# EAGLE design SerialKeyboard (EAGLE 9.4.2)
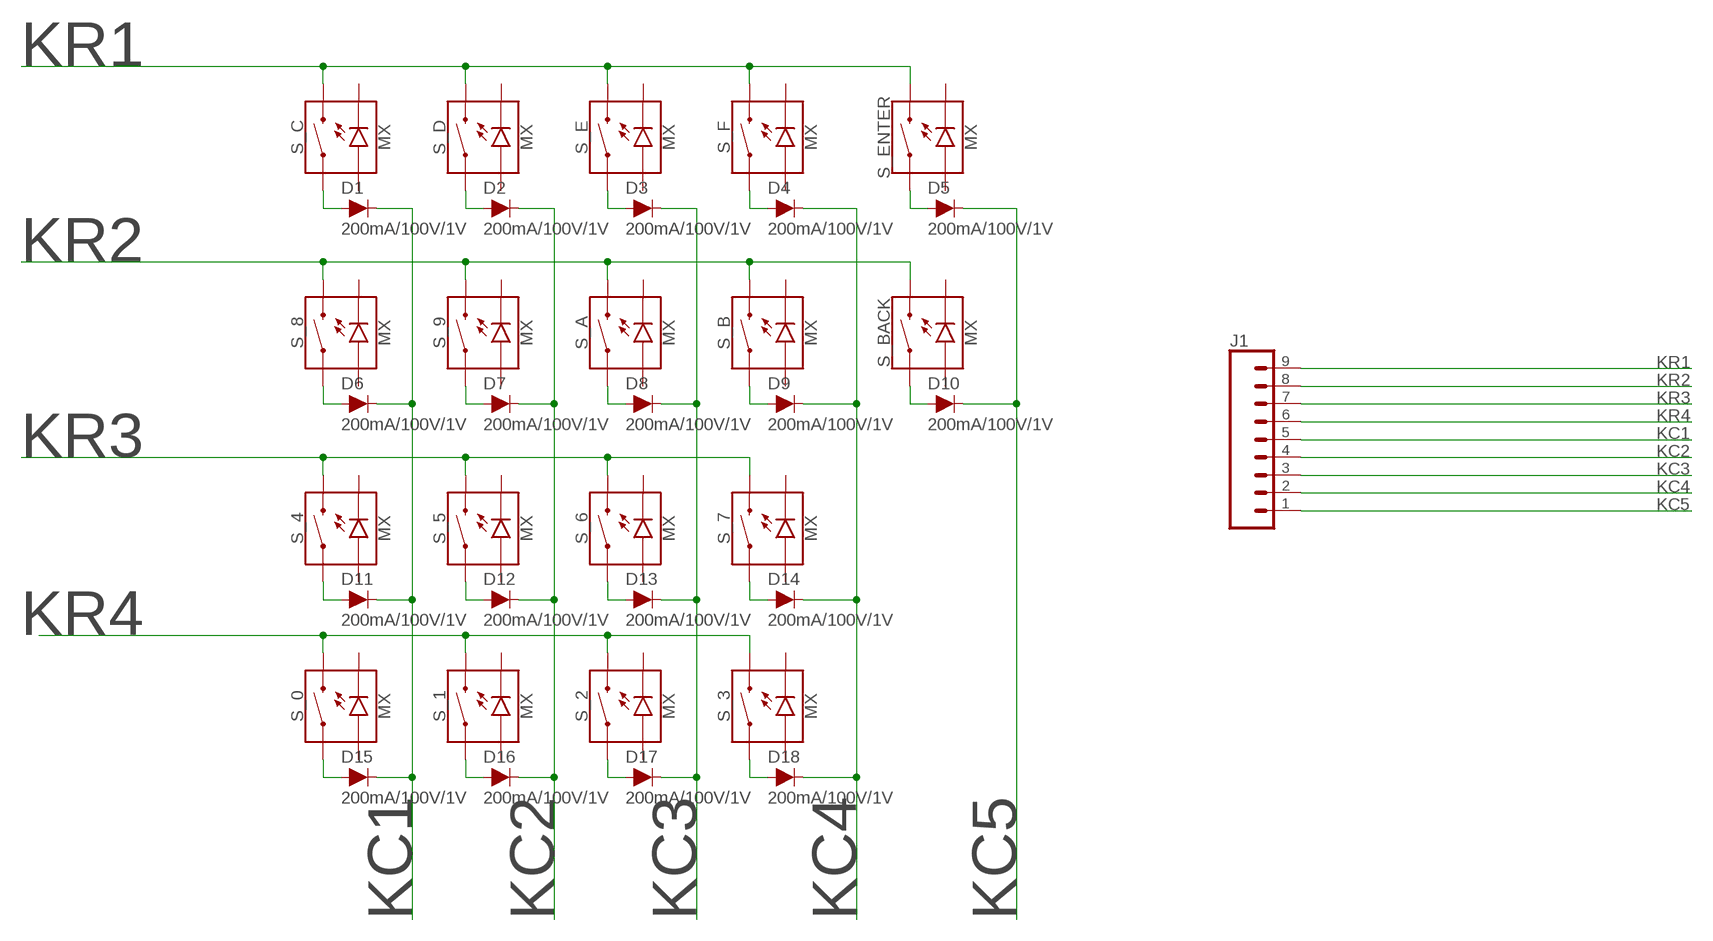
[diagram p0: schematic, sheet 1]

## Parts
D1  200mA/100V/1V  DIODE-1N4148  [DIODE-1N4148]
D2  200mA/100V/1V  DIODE-1N4148  [DIODE-1N4148]
D3  200mA/100V/1V  DIODE-1N4148  [DIODE-1N4148]
D4  200mA/100V/1V  DIODE-1N4148  [DIODE-1N4148]
D5  200mA/100V/1V  DIODE-1N4148  [DIODE-1N4148]
D6  200mA/100V/1V  DIODE-1N4148  [DIODE-1N4148]
D7  200mA/100V/1V  DIODE-1N4148  [DIODE-1N4148]
D8  200mA/100V/1V  DIODE-1N4148  [DIODE-1N4148]
D9  200mA/100V/1V  DIODE-1N4148  [DIODE-1N4148]
D10  200mA/100V/1V  DIODE-1N4148  [DIODE-1N4148]
D11  200mA/100V/1V  DIODE-1N4148  [DIODE-1N4148]
D12  200mA/100V/1V  DIODE-1N4148  [DIODE-1N4148]
D13  200mA/100V/1V  DIODE-1N4148  [DIODE-1N4148]
D14  200mA/100V/1V  DIODE-1N4148  [DIODE-1N4148]
D15  200mA/100V/1V  DIODE-1N4148  [DIODE-1N4148]
D16  200mA/100V/1V  DIODE-1N4148  [DIODE-1N4148]
D17  200mA/100V/1V  DIODE-1N4148  [DIODE-1N4148]
D18  200mA/100V/1V  DIODE-1N4148  [DIODE-1N4148]
J1  CONN_09  [1X09]
S_0  MX  MOMENTARY-SWITCH-SPST-LED-PTH-CHERRY  [CHERRY-MX-LED]
S_1  MX  MOMENTARY-SWITCH-SPST-LED-PTH-CHERRY  [CHERRY-MX-LED]
S_2  MX  MOMENTARY-SWITCH-SPST-LED-PTH-CHERRY  [CHERRY-MX-LED]
S_3  MX  MOMENTARY-SWITCH-SPST-LED-PTH-CHERRY  [CHERRY-MX-LED]
S_4  MX  MOMENTARY-SWITCH-SPST-LED-PTH-CHERRY  [CHERRY-MX-LED]
S_5  MX  MOMENTARY-SWITCH-SPST-LED-PTH-CHERRY  [CHERRY-MX-LED]
S_6  MX  MOMENTARY-SWITCH-SPST-LED-PTH-CHERRY  [CHERRY-MX-LED]
S_7  MX  MOMENTARY-SWITCH-SPST-LED-PTH-CHERRY  [CHERRY-MX-LED]
S_8  MX  MOMENTARY-SWITCH-SPST-LED-PTH-CHERRY  [CHERRY-MX-LED]
S_9  MX  MOMENTARY-SWITCH-SPST-LED-PTH-CHERRY  [CHERRY-MX-LED]
S_A  MX  MOMENTARY-SWITCH-SPST-LED-PTH-CHERRY  [CHERRY-MX-LED]
S_B  MX  MOMENTARY-SWITCH-SPST-LED-PTH-CHERRY  [CHERRY-MX-LED]
S_BACK  MX  MOMENTARY-SWITCH-SPST-LED-PTH-CHERRY  [CHERRY-MX-LED]
S_C  MX  MOMENTARY-SWITCH-SPST-LED-PTH-CHERRY  [CHERRY-MX-LED]
S_D  MX  MOMENTARY-SWITCH-SPST-LED-PTH-CHERRY  [CHERRY-MX-LED]
S_E  MX  MOMENTARY-SWITCH-SPST-LED-PTH-CHERRY  [CHERRY-MX-LED]
S_ENTER  MX  MOMENTARY-SWITCH-SPST-LED-PTH-CHERRY  [CHERRY-MX-LED]
S_F  MX  MOMENTARY-SWITCH-SPST-LED-PTH-CHERRY  [CHERRY-MX-LED]

## Nets
KC1: D1.C D6.C D11.C D15.C J1.5
KC2: D2.C D7.C D12.C D16.C J1.4
KC3: D3.C D8.C D13.C D17.C J1.3
KC4: D4.C D9.C D14.C D18.C J1.2
KC5: D5.C D10.C J1.1
KR1: J1.9 S_C.S2 S_D.S2 S_E.S2 S_ENTER.S2 S_F.S2
KR2: J1.8 S_8.S2 S_9.S2 S_A.S2 S_B.S2 S_BACK.S2
KR3: J1.7 S_4.S2 S_5.S2 S_6.S2 S_7.S2
KR4: J1.6 S_0.S2 S_1.S2 S_2.S2 S_3.S2
N$5: D15.A S_0.S1
N$6: D16.A S_1.S1
N$7: D17.A S_2.S1
N$8: D18.A S_3.S1
N$9: D11.A S_4.S1
N$10: D12.A S_5.S1
N$11: D13.A S_6.S1
N$12: D14.A S_7.S1
N$13: D6.A S_8.S1
N$14: D7.A S_9.S1
N$15: D8.A S_A.S1
N$16: D9.A S_B.S1
N$17: D10.A S_BACK.S1
N$18: D5.A S_ENTER.S1
N$19: D4.A S_F.S1
N$20: D3.A S_E.S1
N$21: D2.A S_D.S1
N$22: D1.A S_C.S1
Unconnected: S_0.A S_0.K(C) S_1.A S_1.K(C) S_2.A S_2.K(C) S_3.A S_3.K(C) S_4.A S_4.K(C) S_5.A S_5.K(C) S_6.A S_6.K(C) S_7.A S_7.K(C) S_8.A S_8.K(C) S_9.A S_9.K(C) S_A.A S_A.K(C) S_B.A S_B.K(C) S_BACK.A S_BACK.K(C) S_C.A S_C.K(C) S_D.A S_D.K(C) S_E.A S_E.K(C) S_ENTER.A S_ENTER.K(C) S_F.A S_F.K(C)

## Library data of the parts
D1-D18 = SparkFun-DiscreteSemi:DIODE: Diode These are standard reverse protection diodes and small signal diodes. SparkFun Products: SparkFun SparkPunk Sound Kit <https://www.sparkfun.com/products/11177> SparkFun ESP8266 Thing <https://www.sparkfun.com/products/13231>; PROD_ID: DIO-08378
J1 = SparkFun-Connectors:CONN_09: Multi connection point. Often used as Generic Header-pin footprint for 0.1 inch spaced/style header connections On any of the 0.1 inch spaced packages, you can populate with these: Break Away Headers - Straight <https://www.sparkfun.com/products/116> (PRT-00116) Break Away Male Headers - Right Angle <https://www.sparkfun.com/products/553> (PRT-00553) Female Headers <https://www.sparkfun.com/products/115> (PRT-00115) Break Away Headers - Machine Pin <https://www.sparkfun.com/products/117> (PRT-00117) Break Away Female Headers - Swiss Machine Pin <https://www.sparkfun.com/products/743> (PRT-00743) For SCREWTERMINALS and SPRING TERMINALS visit here: Screw Terimnals on SparkFun.com <https://www.sparkfun.com/search/results?term=Screw+Terminals> (5mm/3.5mm/2.54mm spacing) This device is also useful as a general connection point to wire up your design to another part of your project. Our various solder wires solder well into these plated through hole pads. Hook-Up Wire - Assortment (Stranded, 22 AWG) <https://www.sparkfun.com/products/11375> (PRT-11375) Hook-Up Wire - Assortment (Solid Core, 22 AWG) <https://www.sparkfun.com/products/11367> (PRT-11367) View the entire wire category on our website here <https://www.sparkfun.com/categories/141> Special notes: Molex polarized connector foot print use with SKU : PRT-08231 with associated crimp pins and housings. 1MM SMD Version SKU: PRT-10208 NOTES ON THE VARIANTS LOCK and LOCK_LONGPADS... This footprint was designed to help hold the alignment of a through-hole component (i.e. 6-pin header) while soldering it into place. You may notice that each hole has been shifted either up or down by 0.005 of an inch from it's more standard position (which is a perfectly straight line). This slight alteration caused the pins (the squares in the middle) to touch the edges of the holes. Because they are alternating, it causes a "brace" to hold the component in place. 0.005 has proven to be the perfect amount of "off-center" position when using our standard breakaway headers. Although looks a little odd when you look at the bare footprint, once you have a header in there, the alteration is very hard to notice. Also,if you push a header all the way into place, it is covered up entirely on the bottom side.
S_0 S_1-S_9 S_A S_B S_BACK S_C S_D S_E S_ENTER S_F = SparkFun-Switches:MOMENTARY-SWITCH-SPST-LED: Momentary Switch (Pushbutton) - SPST - w/ LED Normally-open (NO) SPST momentary switches (buttons, pushbuttons), with a built-in LED. Variants PTH-CHERRY - Cherry MX Switch Cherry MX Keyswitches are top-of-the-line mechanical keyboard switches. They’re satisfyingly “clicky”, reliable up to tens-of-millions of key presses, and a standard in gaming and programming keyboards across the globe. This ‘blue’ version Cherry MX Switch is favored by most due to its secondary internal actuator making it less likely to “double-tap.” If you are looking for a noticeably audible and high-quality key switch, this is the perfect option for you! Cherry MX Switch <https://www.sparkfun.com/products/13834> (COM-13834) Cherry MX Switch Breakout <https://www.sparkfun.com/products/13773> (BOB-13773) PTH-12MM and PTH-12MM-KIT - 12mm Illuminated LED KIT variant is for soldering kits. There is no tStop (covering up the top side of the pads with mask). This helps the beginner see which side they should be soldering too. LED Tactile Button Breakout <https://www.sparkfun.com/products/10467> (BOB-10467) LED Tactile Button - Red <https://www.sparkfun.com/products/10442> (COM-10442) LED Tactile Button - Blue <https://www.sparkfun.com/products/10443> (COM-10443) LED Tactile Button - Green <https://www.sparkfun.com/products/10440> (COM-10440) LED Tactile Button - Orange <https://www.sparkfun.com/products/10441> (COM-10441) LED Tactile Button - White <https://www.sparkfun.com/products/10439> (COM-10439); SF_ID: COM-13834

## Board
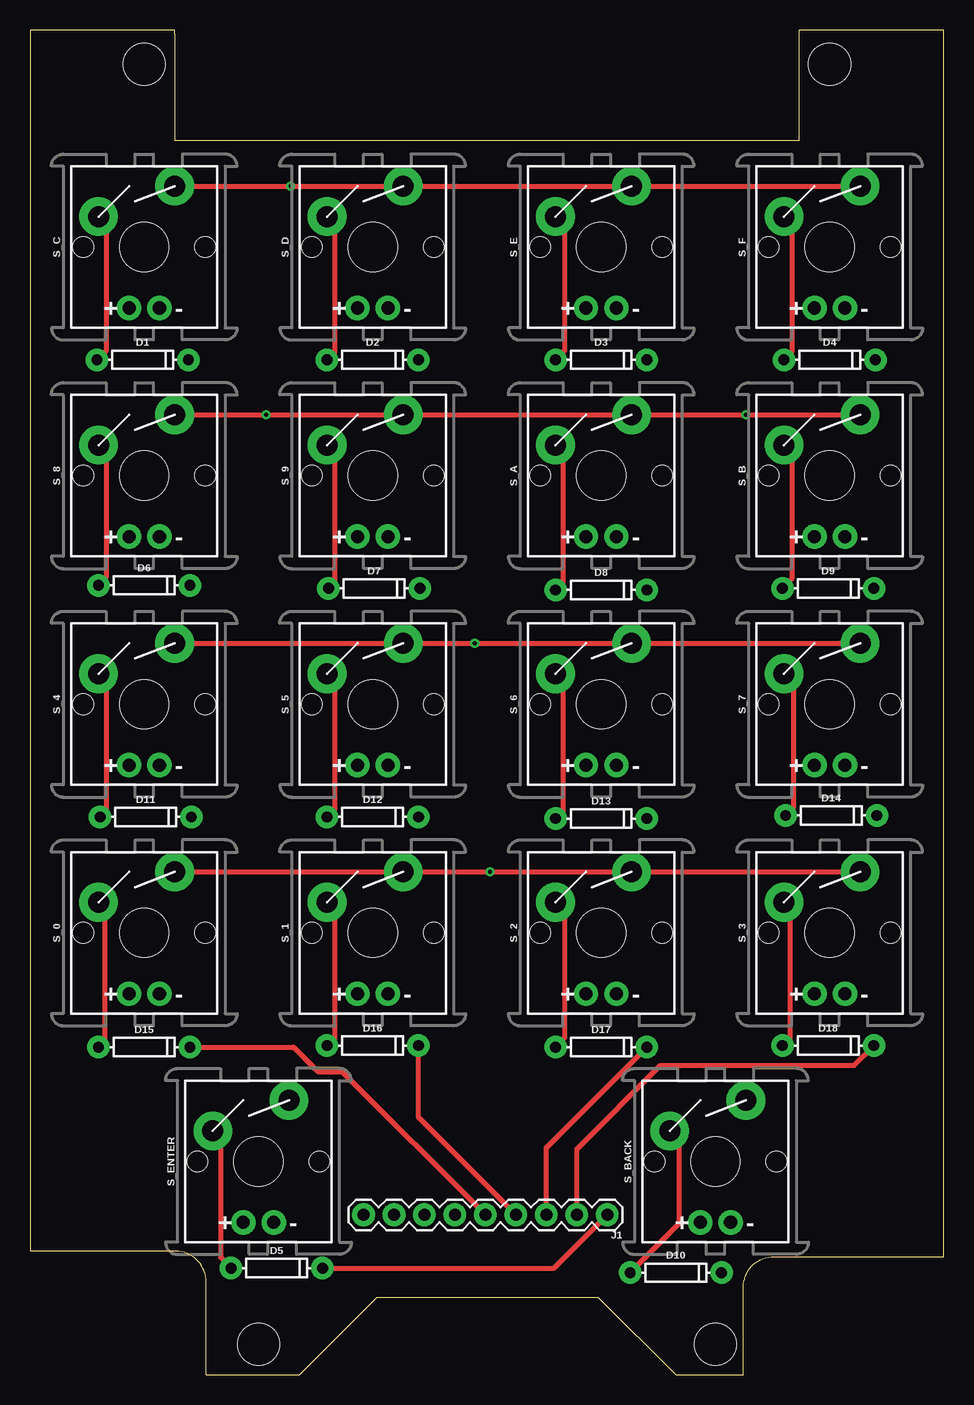
[diagram p1: board, top side]
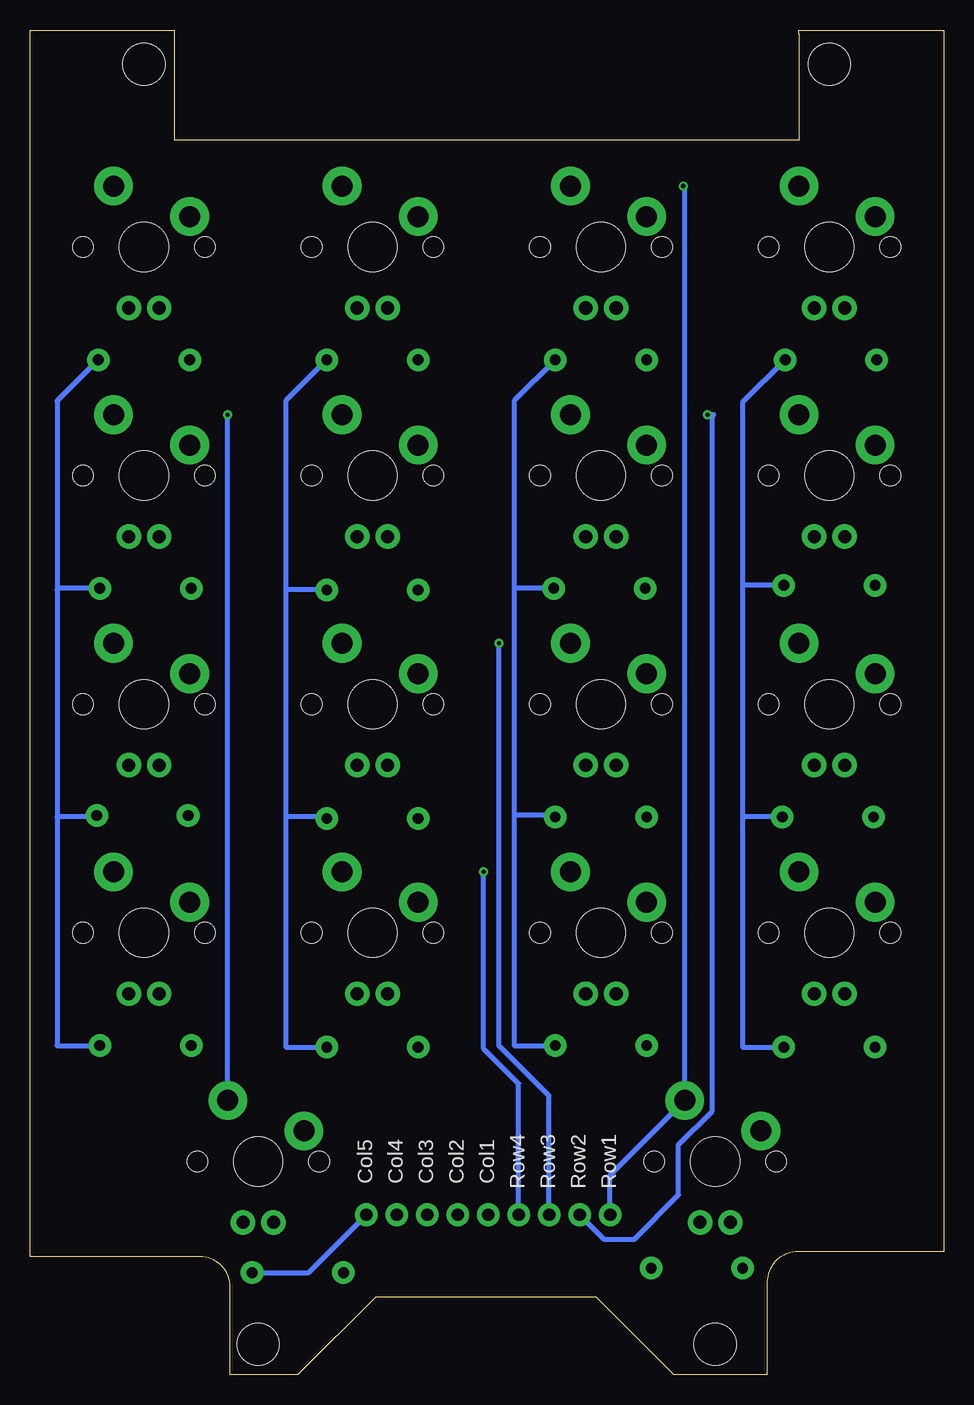
[diagram p2: board, bottom side, seen from below]

Size 76.18 x 112.06 mm. Coordinates in mm from the lower left corner, seen from the top.
Outline: 12.07,112.06 0,112.06 0,10.29 12.14,10.29 arc-90 14.68,7.75 14.68,0 22.48,0 28.96,6.48 47.37,6.48 53.85,0 59.49,0 59.49,7.32 arc-90 62.03,9.86 76.18,9.86 76.18,112.06 64.14,112.06 64.14,102.87 20.95,102.87 12.07,102.87 12.07,111.76 12.07,112.06
Copper layers (1*16): Top 0.035mm / dielectric 1.5mm / Bottom 0.035mm
Design rules "default": minimum track width 6mil, minimum drill 0.35mm, track to track 6mil, track to pad 6mil, pad to pad 6mil, via to via 6mil, smd to smd 6mil, copper to edge 40mil, drill to drill 6mil, minimum pad ring 10mil, minimum via ring 8mil, stop-mask expansion 4mil, vias tented up to drill 0mil, thermal gap 10mil
Holes 3.5 mm at 9.53,109.22 66.67,109.22 19.05,2.54 57.15,2.54

### Footprints (pad centres in the part's own frame; a part is rotated, then mirrored left to right if it is on the bottom)
DIODE-1N4148 = drill 0.9 pad 1.88: A -3.81,0; C 3.81,0
1X09 = drill 1.016 pad 1.88: 1 0,0; 2 2.54,0; 3 5.08,0; 4 7.62,0; 5 10.16,0; 6 12.7,0; 7 15.24,0; 8 17.78,0; 9 20.32,0
CHERRY-MX-LED = drill 1.092 pad 2.032: A -1.27,-5.08; K 1.27,-5.08 | drill 1.753 pad 3.226: S1 -3.81,2.54; S2 2.54,5.08 | hole 4.089: 0,0 | hole 1.707: -5.08,0; 5.08,0

### Placement (x,y rotation side)
D1  9.4,84.58 0 top
D2  28.58,84.58 0 top
D3  47.62,84.58 0 top
D4  66.67,84.58 0 top
D5  20.57,8.89 0 top
D6  9.53,65.79 0 top
D7  28.7,65.53 0 top
D8  47.62,65.41 0 top
D9  66.55,65.53 0 top
D10  53.85,8.51 0 top
D11  9.65,46.48 0 top
D12  28.58,46.48 0 top
D13  47.62,46.36 0 top
D14  66.8,46.61 0 top
D15  9.53,27.3 0 top
D16  28.58,27.43 0 top
D17  47.62,27.3 0 top
D18  66.55,27.43 0 top
J1  48.13,13.34 180 top
S_0  9.53,36.83 0 top
S_1  28.58,36.83 0 top
S_2  47.62,36.83 0 top
S_3  66.67,36.83 0 top
S_4  9.53,55.88 0 top
S_5  28.58,55.88 0 top
S_6  47.62,55.88 0 top
S_7  66.67,55.88 0 top
S_8  9.53,74.93 0 top
S_9  28.58,74.93 0 top
S_A  47.62,74.93 0 top
S_B  66.67,74.93 0 top
S_BACK  57.15,17.78 0 top
S_C  9.53,93.98 0 top
S_D  28.58,93.98 0 top
S_E  47.62,93.98 0 top
S_ENTER  19.05,17.78 0 top
S_F  66.67,93.98 0 top

### Tracks (layer width: path | path; a pad name or v marks a point on that pad's centre or on a via)
KC1
  Top 0.406: D15.C 21.97,27.3 24,25.27 26.04,25.27 J1.5
  Bottom 0.406: D1.C 16.76,81.03 16.76,65.91 | D15.C 16.76,27.3 16.76,46.36 | 16.76,65.91 16.76,46.36 | D11.C 16.64,46.48 16.76,46.36 | D6.C 16.64,65.79 16.76,65.91
KC2
  Top 0.406: J1.4 32.38,21.46 D16.C
  Bottom 0.406: D2.C 35.81,81.15 35.81,65.53 | D16.C 35.81,27.43 35.81,46.61 | 35.81,65.53 35.81,46.61 | D12.C 32.51,46.61 35.81,46.61 | D7.C 35.81,65.53
KC3
  Top 0.406: J1.3 43.05,18.92 D17.C
  Bottom 0.406: D3.C 54.86,81.15 54.86,65.28 | D17.C 54.86,27.3 54.86,46.48 | 54.86,65.28 54.86,46.48 | D13.C 51.56,46.48 54.86,46.48 | D8.C 54.74,65.41 54.86,65.28
KC4
  Top 0.406: J1.2 45.59,18.8 52.58,25.78 68.71,25.78 D18.C
  Bottom 0.406: D4.C 73.91,81.15 73.91,65.41 | D18.C 73.91,27.43 73.91,46.48 | 73.91,65.41 73.91,46.48 | D14.C 70.74,46.48 73.91,46.48 | D9.C 73.79,65.53 73.91,65.41
KC5
  Top 0.406: D5.C 43.69,8.89 J1.1
  Bottom 0.406: D10.C 52.96,8.51 J1.1
KR1  (via drill 0.35)
  Top 0.406: S_C.S2 v21.72,99.06 S_D.S2 S_E.S2 S_F.S2
  Bottom 0.406: v21.72,99.06 21.59,98.93 S_ENTER.S2 27.81,16.64 J1.9
KR2  (via drill 0.35)
  Top 0.406: S_8.S2 v19.69,80.01 S_9.S2 S_A.S2 v59.69,80.01 S_B.S2
  Bottom 0.406: S_BACK.S2 v59.69,80.01 | J1.8 28.32,11.3 25.78,11.3 22.1,14.99 22.1,19.18 19.3,21.97 19.3,79.88 19.18,80.01 v19.69,80.01
KR3  (via drill 0.35)
  Top 0.406: S_4.S2 S_5.S2 v37.08,60.96 S_6.S2 S_7.S2
  Bottom 0.406: J1.7 32.89,23.24 37.08,27.43 v37.08,60.96
KR4  (via drill 0.35)
  Top 0.406: S_0.S2 S_1.S2 v38.35,41.91 S_2.S2 S_3.S2
  Bottom 0.406: J1.6 35.43,24.26 38.35,27.18 v38.35,41.91
N$5
  Top 0.406: S_0.S1 6.22,38.86 6.22,27.81 D15.A
N$6
  Top 0.406: S_1.S1 25.4,38.73 25.4,28.07 D16.A
N$7
  Top 0.406: S_2.S1 44.58,38.61 44.58,28.07 D17.A
N$8
  Top 0.406: S_3.S1 63.37,38.86 63.37,28.07 D18.A
N$9
  Top 0.406: S_4.S1 6.35,57.79 6.35,46.99 D11.A
N$10
  Top 0.406: S_5.S1 25.4,57.79 25.4,47.12 D12.A
N$11
  Top 0.406: S_6.S1 44.45,57.79 44.45,46.99 D13.A
N$12
  Top 0.406: S_7.S1 63.63,57.66 63.63,47.24 D14.A
N$13
  Top 0.406: S_8.S1 6.35,76.84 6.35,66.42 D6.A
N$14
  Top 0.406: S_9.S1 25.4,76.84 25.4,66.04 D7.A
N$15
  Top 0.406: S_A.S1 44.45,76.84 44.45,66.04 D8.A
N$16
  Top 0.406: S_B.S1 63.5,76.84 63.5,66.29 D9.A
N$17
  Top 0.406: S_BACK.S1 54.1,19.56 54.1,12.57 D10.A
N$18
  Top 0.406: S_ENTER.S1 15.88,19.69 15.88,9.78 D5.A
N$19
  Top 0.406: S_F.S1 63.5,95.89 63.5,85.22 D4.A
N$20
  Top 0.406: S_E.S1 44.58,95.76 44.58,85.34 D3.A
N$21
  Top 0.406: S_D.S1 25.4,95.89 25.4,85.22 D2.A
N$22
  Top 0.406: S_C.S1 6.35,95.89 6.35,85.34 D1.A

### Text on the board
bPlace: Row1 | Row2 | Row3 | Row4 | Col1 | Col2 | Col3 | Col4 | Col5